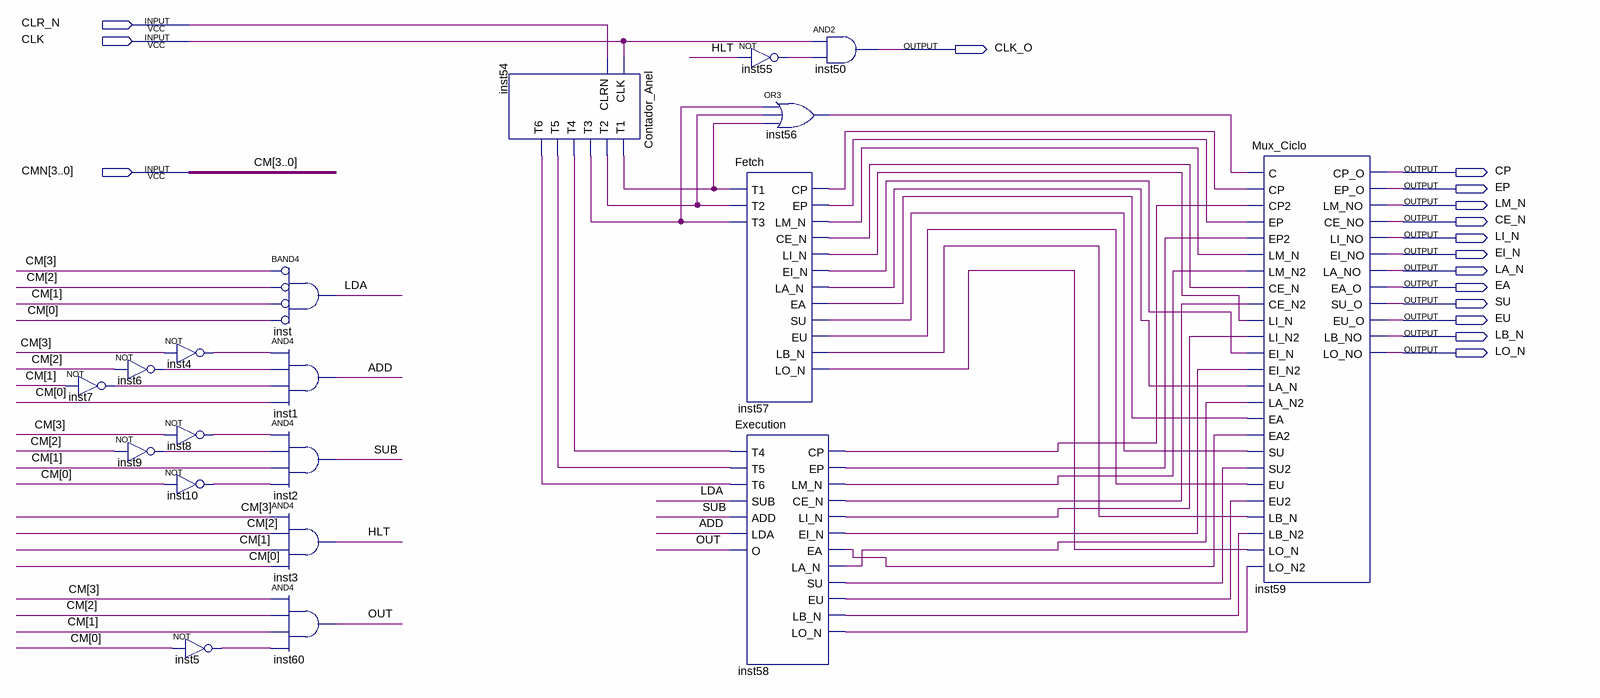
[diagram p0: schematic sheet]
// Quartus schematic Controlador.bdf as structural Verilog: 19 symbols, 16 pins
module Controlador (
  input  CLR_N,
  input  CLK,
  input  [3:0] CMN,
  output CLK_O,
  output CP,
  output EP,
  output LM_N,
  output CE_N,
  output LI_N,
  output EI_N,
  output LA_N,
  output EA,
  output SU,
  output EU,
  output LB_N,
  output LO_N
);

  wire ADD, HLT, inst4_out, inst5_out, inst6_out, inst7_out, inst8_out, inst9_out, inst10_out, inst54_t1,
       inst54_t2, inst54_t3, inst54_t4, inst54_t5, inst54_t6, inst55_out, inst56_out, inst57_ce_n, inst57_cp,
       inst57_ea, inst57_ei_n, inst57_ep, inst57_eu, inst57_la_n, inst57_lb_n, inst57_li_n, inst57_lm_n,
       inst57_lo_n, inst57_su, inst58_ce_n, inst58_cp, inst58_ea, inst58_ei_n, inst58_ep, inst58_eu,
       inst58_la_n, inst58_lb_n, inst58_li_n, inst58_lm_n, inst58_lo_n, inst58_su, LDA, OUT, SUB;

  not inst7 (inst7_out, CMN[1]);
  not inst6 (inst6_out, CMN[2]);
  not inst9 (inst9_out, CMN[2]);
  not inst4 (inst4_out, CMN[3]);
  not inst8 (inst8_out, CMN[3]);
  not inst10 (inst10_out, CMN[0]);
  not inst5 (inst5_out, CMN[0]);
  and inst (LDA, ~CMN[3], ~CMN[2], ~CMN[1], ~CMN[0]);  // BAND4
  and inst1 (ADD, inst4_out, inst6_out, inst7_out, CMN[0]);
  and inst2 (SUB, inst8_out, inst9_out, CMN[1], inst10_out);
  and inst3 (HLT, CMN[3], CMN[2], CMN[1], CMN[0]);
  and inst60 (OUT, CMN[3], CMN[2], CMN[1], inst5_out);
  Contador_Anel inst54 (
    .CLK(CLK), .CLRN(CLR_N), .T1(inst54_t1), .T2(inst54_t2), .T3(inst54_t3), .T4(inst54_t4), .T5(inst54_t5),
    .T6(inst54_t6));
  not inst55 (inst55_out, HLT);
  Fetch inst57 (
    .T1(inst54_t1), .T2(inst54_t2), .T3(inst54_t3), .CP(inst57_cp), .EP(inst57_ep), .LM_N(inst57_lm_n),
    .CE_N(inst57_ce_n), .LI_N(inst57_li_n), .EI_N(inst57_ei_n), .LA_N(inst57_la_n), .EA(inst57_ea),
    .SU(inst57_su), .EU(inst57_eu), .LB_N(inst57_lb_n), .LO_N(inst57_lo_n));
  Execution inst58 (
    .T4(inst54_t4), .T5(inst54_t5), .T6(inst54_t6), .SUB(LDA), .ADD(SUB), .LDA(ADD), .O(OUT), .CP(inst58_cp),
    .EP(inst58_ep), .LM_N(inst58_lm_n), .CE_N(inst58_ce_n), .LI_N(inst58_li_n), .EI_N(inst58_ei_n),
    .EA(inst58_ea), .LA_N(inst58_la_n), .SU(inst58_su), .EU(inst58_eu), .LB_N(inst58_lb_n), .LO_N(inst58_lo_n));
  and inst50 (CLK_O, CLK, inst55_out);
  or inst56 (inst56_out, inst54_t3, inst54_t2, inst54_t1);
  Mux_Ciclo inst59 (
    .C(inst56_out), .CP(inst57_cp), .CP2(inst58_cp), .EP(inst57_ep), .EP2(inst58_ep), .LM_N(inst57_lm_n),
    .LM_N2(inst58_lm_n), .CE_N(inst57_ce_n), .CE_N2(inst58_ce_n), .LI_N(inst57_li_n), .LI_N2(inst58_li_n),
    .EI_N(inst57_ei_n), .EI_N2(inst58_ei_n), .LA_N(inst57_la_n), .LA_N2(inst58_la_n), .EA(inst57_ea),
    .EA2(inst58_ea), .SU(inst57_su), .SU2(inst58_su), .EU(inst57_eu), .EU2(inst58_eu), .LB_N(inst57_lb_n),
    .LB_N2(inst58_lb_n), .LO_N(inst57_lo_n), .LO_N2(inst58_lo_n), .CP_O(CP), .EP_O(EP), .LM_NO(LM_N),
    .CE_NO(CE_N), .LI_NO(LI_N), .EI_NO(EI_N), .LA_NO(LA_N), .EA_O(EA), .SU_O(SU), .EU_O(EU), .LB_NO(LB_N),
    .LO_NO(LO_N));

  // Other names for the same wires on the sheet: CM[3:0] = CMN
endmodule
